# EAGLE design MSX Paddle Revisited (EAGLE 7.3.0)
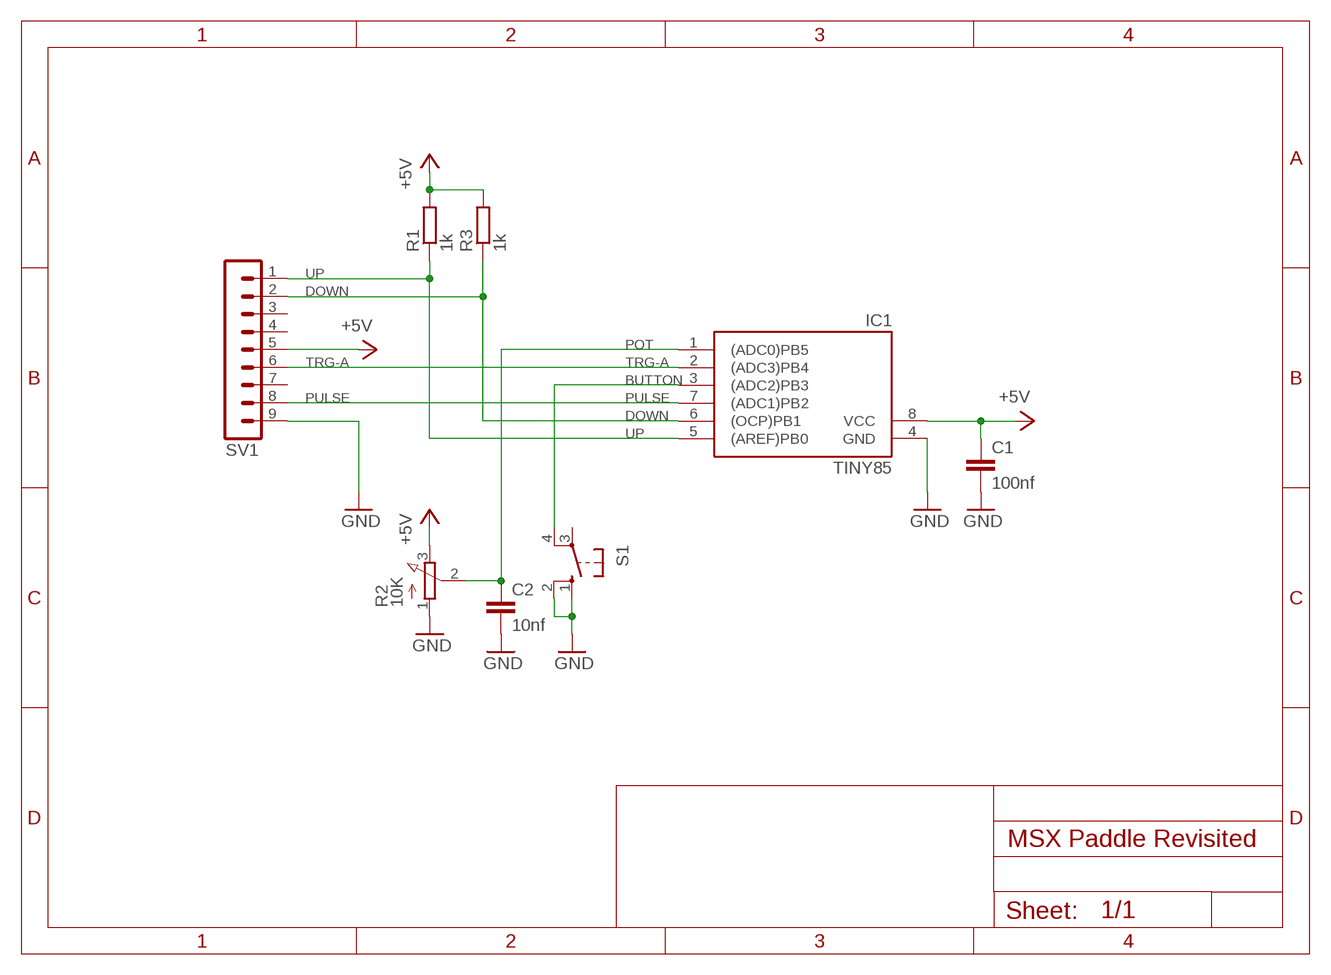
[diagram p0: schematic, sheet 1]

## Parts
C1  100nf  C-EU050-024X044  [C050-024X044]
C2  10nf  C-EU050-024X044  [C050-024X044]
IC1  TINY85  TINY15LP  [DIL08]
R1  1k  R-EU_0204/7  [0204/7]
R2  10K  3RP/1610NTHRU  [3RP/1610N_THRU]
R3  1k  R-EU_0204/7  [0204/7]
S1  40-XX  [B3F-40XX]
SV1  MA09-1  [MA09-1]

## Nets
+5V: C1.1 IC1.8(VCC) R1.2 R2.3(E) R3.2 SV1.5
BUTTON: IC1.3((ADC2)PB3) S1.4(P1)
DOWN: IC1.6((OCP)PB1) R3.1 SV1.2
GND: C1.2 C2.2 IC1.4(GND) R2.1(A) S1.1(S) S1.2(S1) SV1.9
POT: C2.1 IC1.1((ADC0)PB5) R2.2(S)
PULSE: IC1.7((ADC1)PB2) SV1.8
TRG-A: IC1.2((ADC3)PB4) SV1.6
UP: IC1.5((AREF)PB0) R1.1 SV1.1
Unconnected: S1.3(P) SV1.3 SV1.4 SV1.7

## Library data of the parts
C1 C2 = rcl:C-EU: CAPACITOR, European symbol
IC1 = atmel:TINY15L: MICROCONTROLLER 2.7 V 1 Kbytes FLASH 64 bytes EEPROM 4-channel 10 bit ADC; OC_FARNELL: unknown; OC_NEWARK: unknown
R1 R3 = rcl:R-EU_: RESISTOR, European symbol
R2 = Pontentiometer:3RP/1610N: 16mm Potentiometer one level Source: http://www.alphapotentiometers.net/html/16mm_pot_2.html
S1 = switch-omron:40-XX: OMRON SWITCH
SV1 = con-lstb:MA09-1: PIN HEADER; OC_FARNELL: unknown; OC_NEWARK: unknown

## Board
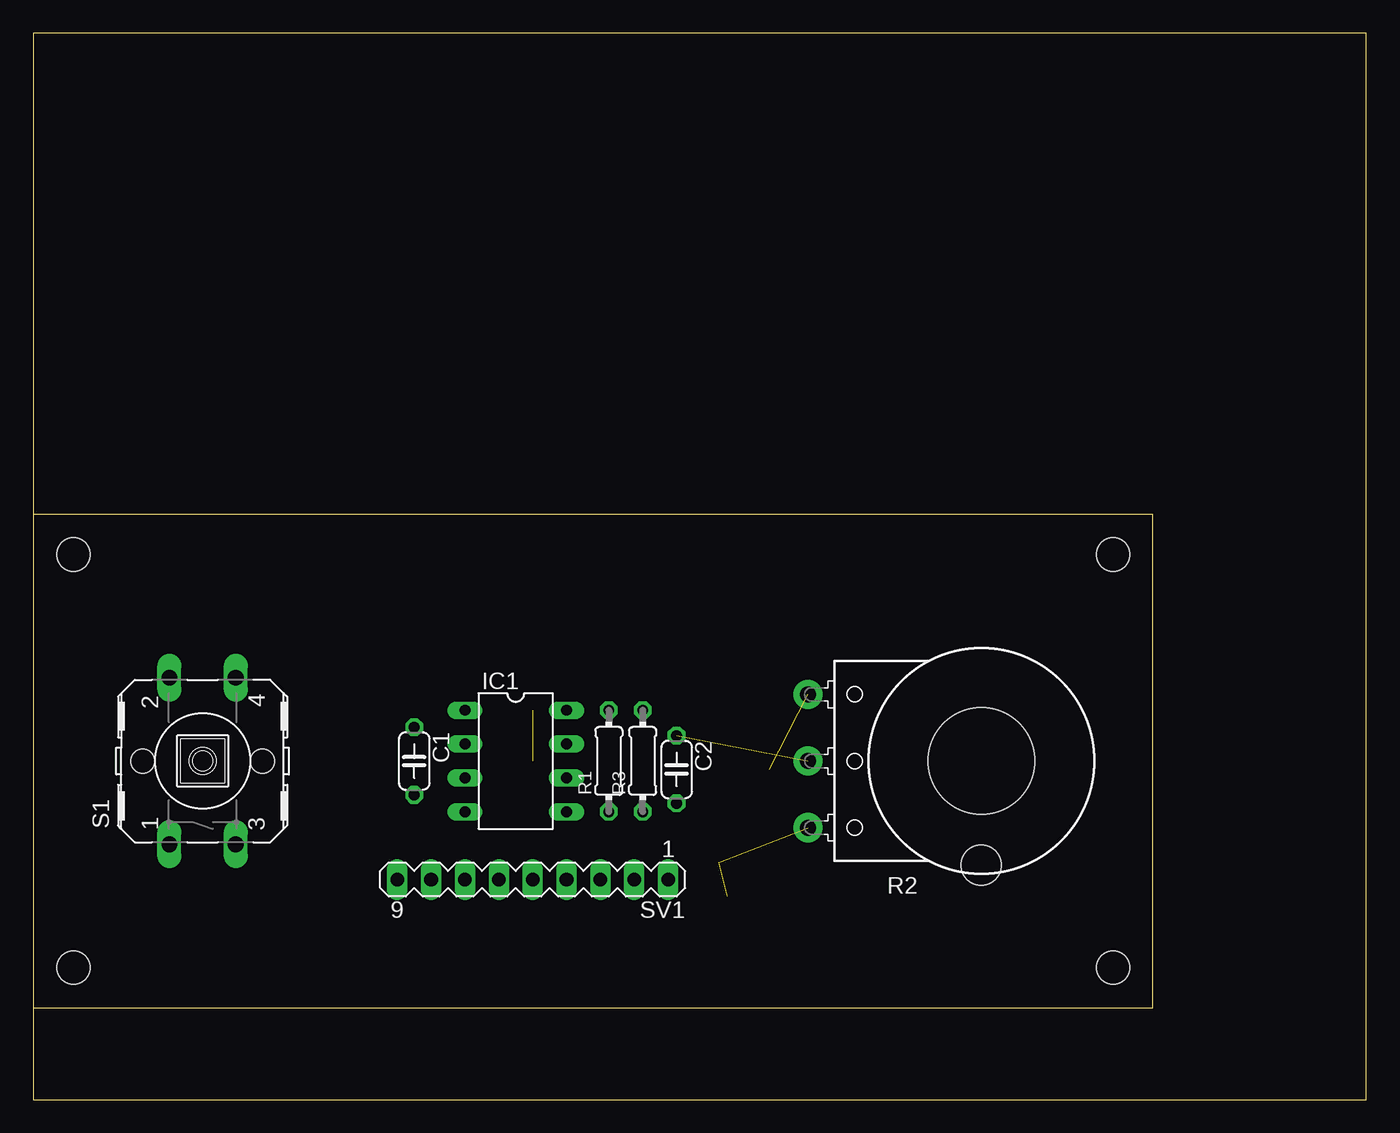
[diagram p1: board, top side]
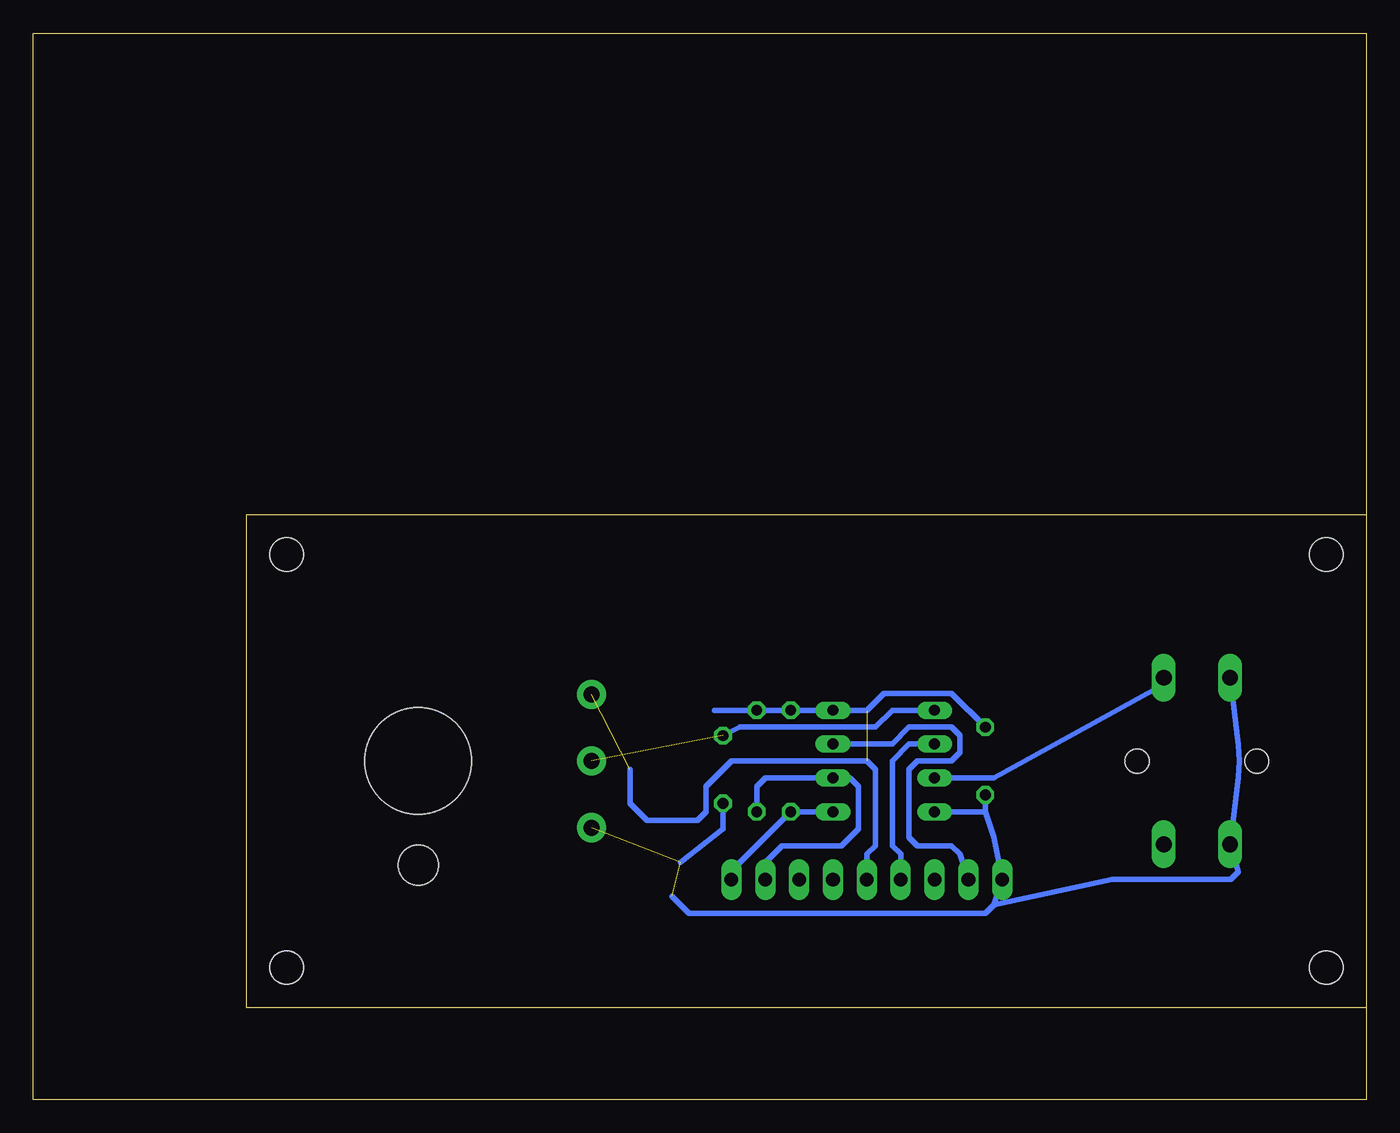
[diagram p2: board, bottom side, seen from below]

Size 100 x 80 mm. Coordinates in mm from the lower left corner, seen from the top.
Outline: 0,0 100,0 100,80 0,80 0,0
Copper layers (1*16): Top 0.035mm / dielectric 1.5mm / Bottom 0.035mm
Design rules "default": minimum track width 10mil, minimum drill 24mil, track to track 8mil, track to pad 8mil, pad to pad 8mil, via to via 8mil, smd to smd 8mil, copper to edge 40mil, drill to drill 8mil, minimum pad ring 10mil, minimum via ring 8mil, stop-mask expansion 4mil, vias tented up to drill 0mil, thermal gap 10mil

### Footprints (pad centres in the part's own frame; a part is rotated, then mirrored left to right if it is on the bottom)
C050-024X044 = drill 0.813 octagon: 1 -2.54,0; 2 2.54,0
DIL08 = drill 0.813 long: 1 -3.81,-3.81; 2 -1.27,-3.81; 3 1.27,-3.81; 4 3.81,-3.81; 5 3.81,3.81; 6 1.27,3.81; 7 -1.27,3.81; 8 -3.81,3.81
0204/7 = drill 0.813 octagon: 1 -3.81,0; 2 3.81,0
3RP/1610N_THRU = drill 1.2 pad 2.184: 1 -5,13; 2 0,13; 3 5,13 | hole 8: 0,0 | hole 3: -7.8,0
B3F-40XX = drill 1.194 long: 1 -6.248,2.489; 2 6.248,2.489; 3 -6.248,-2.489; 4 6.248,-2.489 | hole 1.803: 0,-4.496; 0,4.496
MA09-1 = drill 1.016 long: 1 -10.16,0; 2 -7.62,0; 3 -5.08,0; 4 -2.54,0; 5 0,0; 6 2.54,0; 7 5.08,0; 8 7.62,0; 9 10.16,0
CP-011 = hole 2.5: 3,-15.5; 3,15.5; 81,15.5; 81,-15.5

### Placement (x,y rotation side)
C1  28.57,25.4 270 top
C2  48.26,24.77 270 top
IC1  36.2,25.4 270 top
R1  43.18,25.4 90 top
R2  71.12,25.4 90 top
R3  45.72,25.4 90 top
S1  12.7,25.4 90 top
SV1  37.47,16.51 180 top
U$1  [CP-011]  0,25.4 0 top

### Tracks (layer width: path | path; a pad name or v marks a point on that pad's centre or on a via)
+5V  (2 unrouted)
  Bottom 0.406: C1.1 31.11,30.48 36.2,30.48 37.47,29.21 IC1.8 R1.2 R3.2 48.9,29.21 | SV1.5 37.47,18.41 36.83,19.05 36.83,24.77 37.47,25.4 47.62,25.4 49.53,23.5 49.53,21.59 50.16,20.95 53.98,20.95 55.24,22.23 55.24,24.77
BUTTON
  Bottom 0.406: IC1.3 27.94,24.13 15.24,31.11 15.24,30.96 S1.4
DOWN
  Bottom 0.406: R3.1 45.72,23.5 45.09,24.13 IC1.6 38.73,24.13 38.1,23.5 38.1,20.32 39.37,19.05 43.81,19.05 45.09,17.78 SV1.2
GND  (2 unrouted)
  Bottom 0.406: C1.2 28.57,21.59 | 28.57,21.59 IC1.4 | 28.57,21.59 27.94,19.68 SV1.9 27.94,14.61 | 52.07,15.24 50.8,13.97 28.57,13.97 27.94,14.61 | S1.2 9.58,26.62 9.53,25.4 9.58,24.18 S1.1 9.58,17.09 10.16,16.51 19.05,16.51 27.94,14.61 | C2.2 48.26,20.32 51.44,17.78
POT  (1 unrouted)
  Bottom 0.406: IC1.1 35.56,29.21 36.83,27.94 46.99,27.94 C2.1
PULSE
  Bottom 0.406: IC1.7 35.56,26.67 34.29,27.94 31.11,27.94 30.48,27.3 30.48,26.04 31.11,25.4 33.66,25.4 34.29,24.77 34.29,19.68 33.66,19.05 31.11,19.05 30.48,18.41 SV1.8
TRG-A
  Bottom 0.406: IC1.2 34.29,26.67 35.56,25.4 35.56,19.05 34.92,18.41 SV1.6
UP
  Bottom 0.406: SV1.1 47.62,17.14 R1.1 IC1.5